# EAGLE design eTapper1main6 (EAGLE 8.2.2)
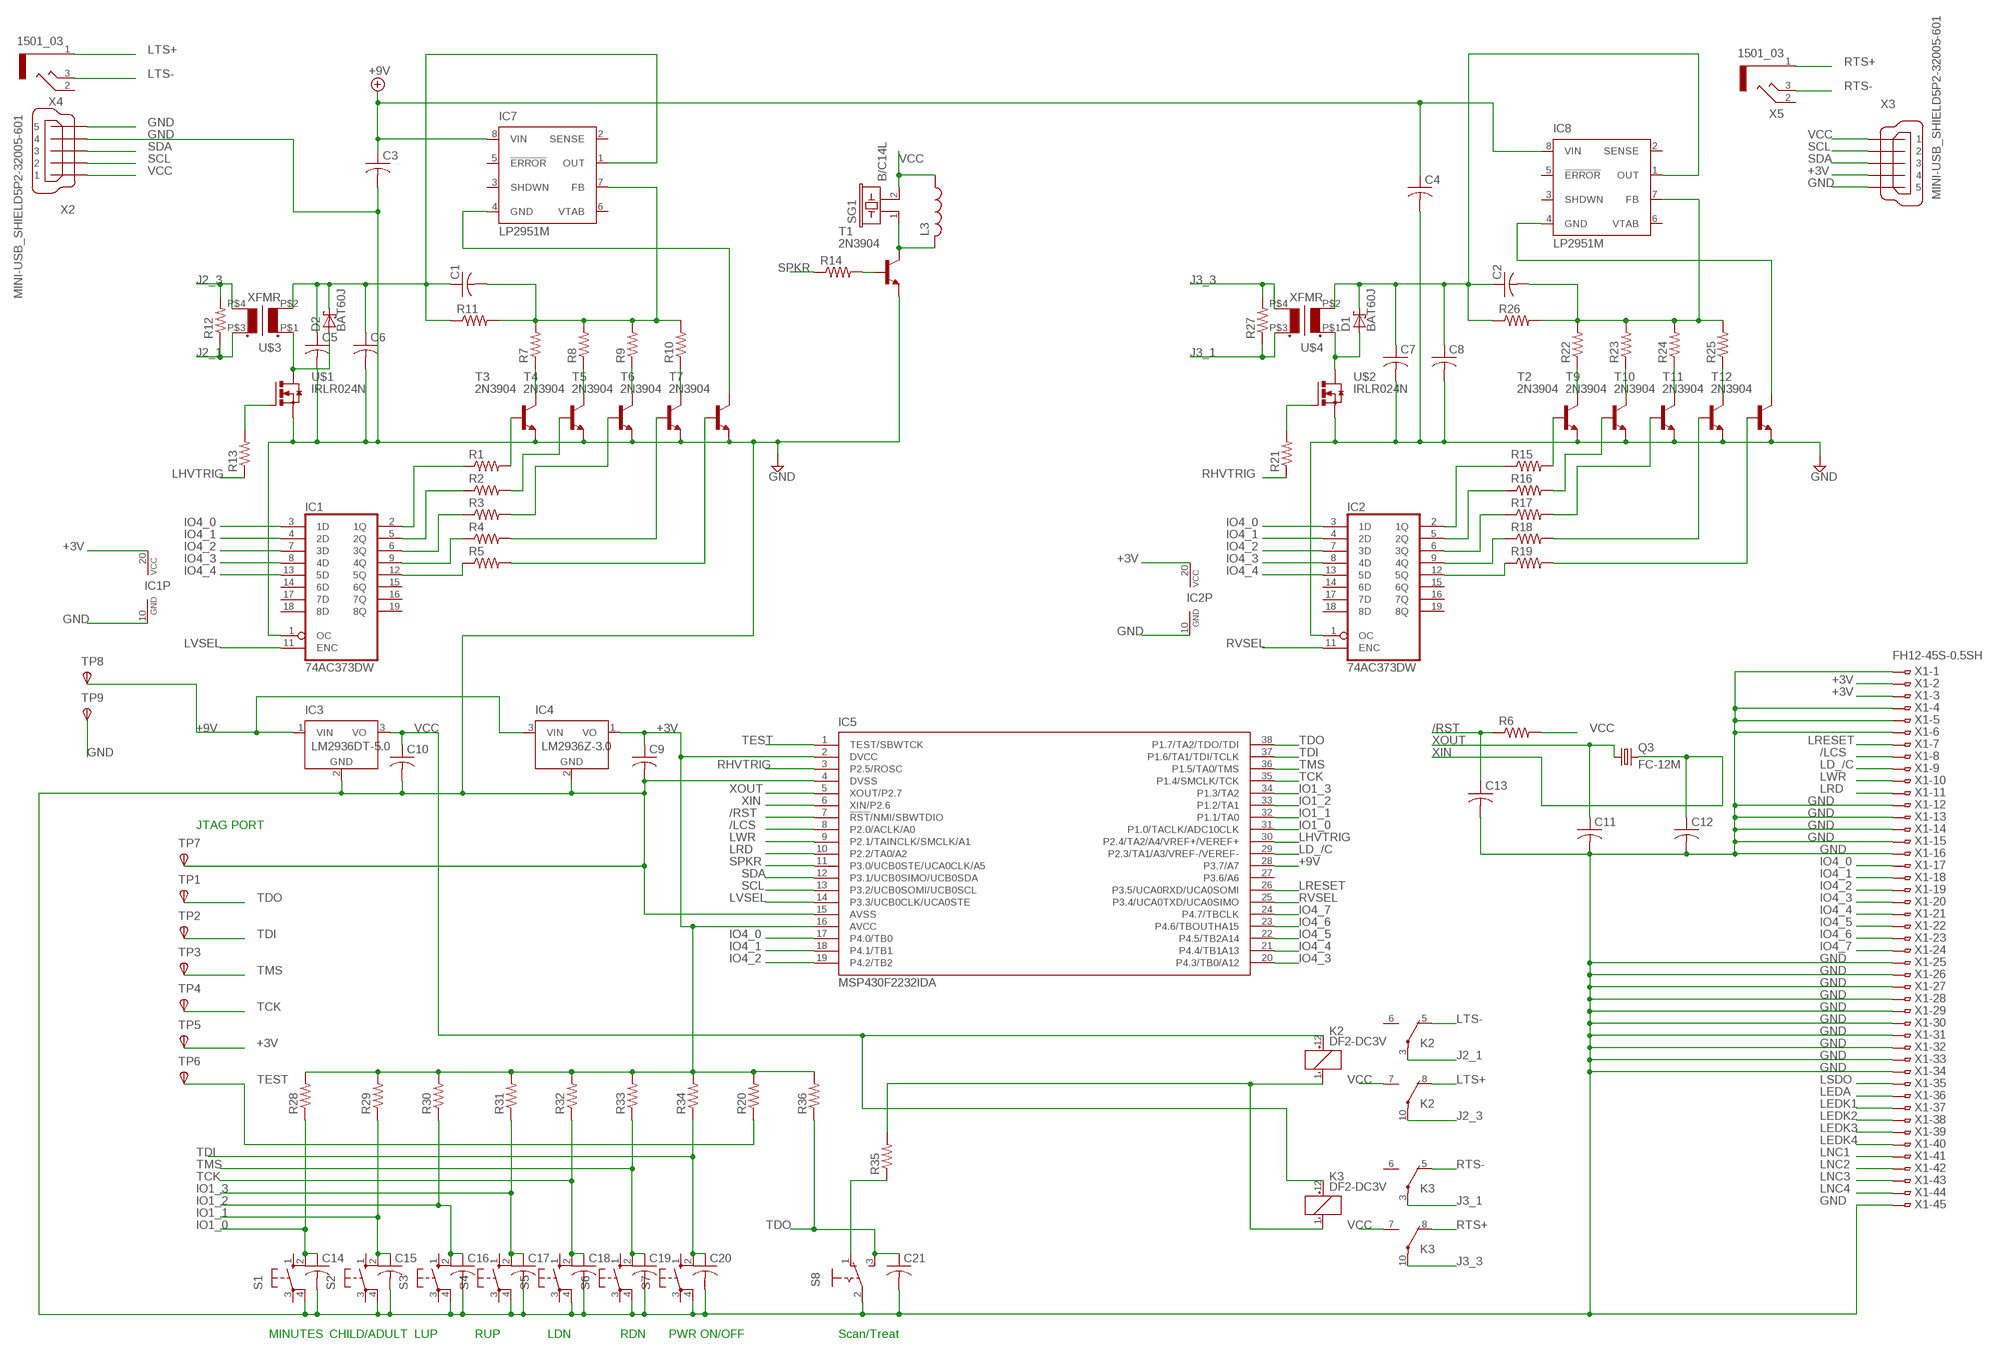
[diagram p0: schematic, sheet 1]

## Parts
C1  C-USC0805  [C0805]
C2  C-USC0805  [C0805]
C3  C-USC0805  [C0805]
C4  C-USC0805  [C0805]
C5  C-USC0805  [C0805]
C6  C-USC0805  [C0805]
C7  C-USC0805  [C0805]
C8  C-USC0805  [C0805]
C9  C-USC0805  [C0805]
C10  C-USC0805  [C0805]
C11  C-USC0805  [C0805]
C12  C-USC0805  [C0805]
C13  C-USC0805  [C0805]
C14  C-USC0805  [C0805]
C15  C-USC0805  [C0805]
C16  C-USC0805  [C0805]
C17  C-USC0805  [C0805]
C18  C-USC0805  [C0805]
C19  C-USC0805  [C0805]
C20  C-USC0805  [C0805]
C21  C-USC0805  [C0805]
D1  BAT60J  [SOD323_ST]
D2  BAT60J  [SOD323_ST]
IC1  74AC373DW  [SO20W]
IC2  74AC373DW  [SO20W]
IC3  LM2936DT-5.0  [TO252]
IC4  LM2936Z-3.0  [TO92]
IC5  MSP430F2232IDA  [TSSOP38_R-PDSO-G38-DA]
IC7  LP2951M  [SO08]
IC8  LP2951M  [SO08]
K2  DF2-DC3V  [DF2]
K3  DF2-DC3V  [DF2]
L3  L-USL2825P  [L2825P]
Q3  FC-12M  [FC-12M]
R1  R-US_R0402  [R0402]
R2  R-US_R0402  [R0402]
R3  R-US_R0402  [R0402]
R4  R-US_R0402  [R0402]
R5  R-US_R0402  [R0402]
R6  R-US_R0402  [R0402]
R7  R-US_R0402  [R0402]
R8  R-US_R0402  [R0402]
R9  R-US_R0402  [R0402]
R10  R-US_R0402  [R0402]
R11  R-US_R0402  [R0402]
R12  R-US_R0402  [R0402]
R13  R-US_R0402  [R0402]
R14  R-US_R0402  [R0402]
R15  R-US_R0402  [R0402]
R16  R-US_R0402  [R0402]
R17  R-US_R0402  [R0402]
R18  R-US_R0402  [R0402]
R19  R-US_R0402  [R0402]
R20  R-US_R0402  [R0402]
R21  R-US_R0402  [R0402]
R22  R-US_R0402  [R0402]
R23  R-US_R0402  [R0402]
R24  R-US_R0402  [R0402]
R25  R-US_R0402  [R0402]
R26  R-US_R0402  [R0402]
R27  R-US_R0402  [R0402]
R28  R-US_R0402  [R0402]
R29  R-US_R0402  [R0402]
R30  R-US_R0402  [R0402]
R31  R-US_R0402  [R0402]
R32  R-US_R0402  [R0402]
R33  R-US_R0402  [R0402]
R34  R-US_R0402  [R0402]
R35  R-US_R0402  [R0402]
R36  R-US_R0402  [R0402]
S1  10-XX  [B3F-10XX]
S2  10-XX  [B3F-10XX]
S3  10-XX  [B3F-10XX]
S4  10-XX  [B3F-10XX]
S5  10-XX  [B3F-10XX]
S6  10-XX  [B3F-10XX]
S7  10-XX  [B3F-10XX]
S8  M251  [M251]
SG1  B/C14L  [B/C14L]
T1  2N3904  [TO92]
T2  2N3904  [TO92]
T3  2N3904  [TO92]
T4  2N3904  [TO92]
T5  2N3904  [TO92]
T6  2N3904  [TO92]
T7  2N3904  [TO92]
T9  2N3904  [TO92]
T10  2N3904  [TO92]
T11  2N3904  [TO92]
T12  2N3904  [TO92]
TP1  TPSTP06R  [TP06R]
TP2  TPSTP06R  [TP06R]
TP3  TPSTP06R  [TP06R]
TP4  TPSTP06R  [TP06R]
TP5  TPSTP06R  [TP06R]
TP6  TPSTP06R  [TP06R]
TP7  TPSTP06R  [TP06R]
TP8  TPSTP06R  [TP06R]
TP9  TPSTP06R  [TP06R]
U$1  IRLR024N  [I-PAK_TO251AA]
U$2  IRLR024N  [I-PAK_TO251AA]
U$3  XFMR  [XFMR]
U$4  XFMR  [XFMR]
X1  FH12-45S-0.5SH  [FH12-45S-0.5SH]
X2  MINI-USB_SHIELD5P2-32005-601  [32005-601]
X3  MINI-USB_SHIELD5P2-32005-601  [32005-601]
X4  1501_03  [1501_03]
X5  1501_03  [1501_03]

## Nets
+3V: C9.1 IC1.20(VCC) IC2.20(VCC) IC4.1(VO) IC5.2(DVCC) IC5.16(AVCC) R20.2 R28.2 R29.2 R30.2 R31.2 R32.2 R33.2 R34.2 R36.2 TP5.TP(PP) X1.2 X1.3 X3.4
+9V: C3.1 C4.1 IC3.1(VIN) IC4.3(VIN) IC5.28(P3.7/A7) IC7.8(VIN) IC8.8(VIN) TP8.TP(PP)
/LCS: IC5.8(P2.0/ACLK/A0) X1.8
/RST: C13.1 IC5.7(!RST!/NMI/SBWTDIO) R6.1
GND: C3.2 C4.2 C5.2 C6.2 C7.2 C8.2 C9.2 C10.2 C11.2 C12.2 C13.2 C14.2 C15.2 C16.2 C17.2 C18.2 C19.2 C20.2 C21.2 IC1.1(OC) IC1.10(GND) IC2.1(OC) IC2.10(GND) IC3.2(GND) IC4.2(GND) IC5.4(DVSS) IC5.15(AVSS) S1.4(P1) S2.4(P1) S3.4(P1) S4.4(P1) S5.4(P1) S6.4(P1) S7.4(P1) S8.2(P) T1.3(E) T2.3(E) T3.3(E) T4.3(E) T5.3(E) T6.3(E) T7.3(E) T9.3(E) T10.3(E) T11.3(E) T12.3(E) TP7.TP(PP) TP9.TP(PP) U$1.3(S) U$2.3(S) X1.1 X1.4 X1.5 X1.6 X1.12 X1.13 X1.14 X1.15 X1.16 X1.25 X1.26 X1.27 X1.28 X1.29 X1.30 X1.31 X1.32 X1.33 X1.34 X1.45 X2.4 X2.5 X3.5
IO1_0: C14.1 IC5.31(P1.0/TACLK/ADC10CLK) R28.1 S1.2(S1)
IO1_1: C15.1 IC5.32(P1.1/TA0) R29.1 S2.2(S1)
IO1_2: C16.1 IC5.33(P1.2/TA1) R30.1 S3.2(S1)
IO1_3: C17.1 IC5.34(P1.3/TA2) R31.1 S4.2(S1)
IO4_0: IC1.3(1D) IC2.3(1D) IC5.17(P4.0/TB0) X1.17
IO4_1: IC1.4(2D) IC2.4(2D) IC5.18(P4.1/TB1) X1.18
IO4_2: IC1.7(3D) IC2.7(3D) IC5.19(P4.2/TB2) X1.19
IO4_3: IC1.8(4D) IC2.8(4D) IC5.20(P4.3/TB0/A12) X1.20
IO4_4: IC1.13(5D) IC2.13(5D) IC5.21(P4.4/TB1A13) X1.21
IO4_5: IC5.22(P4.5/TB2A14) X1.22
IO4_6: IC5.23(P4.6/TBOUTHA15) X1.23
IO4_7: IC5.24(P4.7/TBCLK) X1.24
J2_1: K2.3(2:P) R12.1 U$3.P$3(S1)
J2_3: K2.10(3:P) R12.2 U$3.P$4(S2)
J3_1: K3.3(2:P) R27.1 U$4.P$3(S1)
J3_3: K3.10(3:P) R27.2 U$4.P$4(S2)
LD_/C: IC5.29(P2.3/TA1/A3/VREF-/VEREF-) X1.9
LEDA: X1.36
LEDK1: X1.37
LEDK2: X1.38
LEDK3: X1.39
LEDK4: X1.40
LHVTRIG: IC5.30(P2.4/TA2/A4/VREF+/VEREF+) R13.1
LNC1: X1.41
LNC2: X1.42
LNC3: X1.43
LNC4: X1.44
LRD: IC5.10(P2.2/TA0/A2) X1.11
LRESET: IC5.26(P3.5/UCA0RXD/UCA0SOMI) X1.7
LSDO: X1.35
LTS+: K2.8(3:O) X4.1
LTS-: K2.5(2:O) X4.3
LVSEL: IC1.11(ENC) IC5.14(P3.3/UCB0CLK/UCA0STE)
LWR: IC5.9(P2.1/TAINCLK/SMCLK/A1) X1.10
N$1: IC1.2(1Q) R1.1
N$2: IC1.5(2Q) R2.1
N$3: IC1.6(3Q) R3.1
N$4: IC1.9(4Q) R4.1
N$5: IC1.12(5Q) R5.1
N$6: L3.2 SG1.1 T1.1(C)
N$7: R4.2 T6.2(B)
N$8: R5.2 T7.2(B)
N$9: D2.A U$1.2(D) U$1.4(D) U$3.P$1(P1)
N$10: R7.1 T3.1(C)
N$11: R8.1 T4.1(C)
N$12: R9.1 T5.1(C)
N$13: R1.2 T3.2(B)
N$14: R2.2 T4.2(B)
N$15: R3.2 T5.2(B)
N$16: R10.1 T6.1(C)
N$17: C1.2 IC7.7(FB) R7.2 R8.2 R9.2 R10.2 R11.2
N$18: C1.1 C5.1 C6.1 D2.C IC7.1(OUT) R11.1 U$3.P$2(P2)
N$19: D1.A U$2.2(D) U$2.4(D) U$4.P$1(P1)
N$20: IC2.2(1Q) R15.1
N$21: R13.2 U$1.1(G)
N$22: R14.2 T1.2(B)
N$23: R35.1 S8.1(O)
N$24: IC2.5(2Q) R16.1
N$25: IC2.6(3Q) R17.1
N$26: IC2.9(4Q) R18.1
N$27: IC2.12(5Q) R19.1
N$29: R15.2 T2.2(B)
N$30: R16.2 T9.2(B)
N$31: R17.2 T10.2(B)
N$32: R18.2 T11.2(B)
N$33: R19.2 T12.2(B)
N$34: K2.1(1:-) K3.1(1:-) R35.2
N$35: R22.1 T2.1(C)
N$36: R23.1 T9.1(C)
N$37: R24.1 T10.1(C)
N$38: R25.1 T11.1(C)
N$39: C2.2 IC8.7(FB) R22.2 R23.2 R24.2 R25.2 R26.2
N$40: C2.1 C7.1 C8.1 D1.C IC8.1(OUT) R26.1 U$4.P$2(P2)
N$42: R21.2 U$2.1(G)
N$45: IC7.4(GND) T7.1(C)
N$47: IC8.4(GND) T12.1(C)
RHVTRIG: IC5.3(P2.5/ROSC) R21.1
RTS+: K3.8(3:O) X5.1
RTS-: K3.5(2:O) X5.3
RVSEL: IC2.11(ENC) IC5.25(P3.4/UCA0TXD/UCA0SIMO)
SCL: IC5.13(P3.2/UCB0SOMI/UCB0SCL) X2.2 X3.2
SDA: IC5.12(P3.1/UCB0SIMO/UCB0SDA) X2.3 X3.3
SPKR: IC5.11(P3.0/UCB0STE/UCA0CLK/A5) R14.1
TCK: C18.1 IC5.35(P1.4/SMCLK/TCK) R32.1 S5.2(S1) TP4.TP(PP)
TDI: C20.1 IC5.37(P1.6/TA1/TDI/TCLK) R34.1 S7.2(S1) TP2.TP(PP)
TDO: C21.1 IC5.38(P1.7/TA2/TDO/TDI) R36.1 S8.3(S) TP1.TP(PP)
TEST: IC5.1(TEST/SBWTCK) R20.1 TP6.TP(PP)
TMS: C19.1 IC5.36(P1.5/TA0/TMS) R33.1 S6.2(S1) TP3.TP(PP)
VCC: C10.1 IC3.3(VO) K2.7(3:S) K2.12(1:+) K3.7(3:S) K3.12(1:+) L3.1 R6.2 SG1.2 X2.1 X3.1
XIN: C12.1 IC5.6(XIN/P2.6) Q3.2
XOUT: C11.1 IC5.5(XOUT/P2.7) Q3.1
Unconnected: IC1.14(6D) IC1.15(6Q) IC1.16(7Q) IC1.17(7D) IC1.18(8D) IC1.19(8Q) IC2.14(6D) IC2.15(6Q) IC2.16(7Q) IC2.17(7D) IC2.18(8D) IC2.19(8Q) IC5.27(P3.6/A6) IC7.2(SENSE) IC7.3(SHDWN) IC7.5(!ERROR) IC7.6(VTAB) IC8.2(SENSE) IC8.3(SHDWN) IC8.5(!ERROR) IC8.6(VTAB) K2.6(2:S) K3.6(2:S) S1.1(S) S1.3(P) S2.1(S) S2.3(P) S3.1(S) S3.3(P) S4.1(S) S4.3(P) S5.1(S) S5.3(P) S6.1(S) S6.3(P) S7.1(S) S7.3(P) X2.M1(S1) X2.M2(S2) X3.M1(S1) X3.M2(S2) X4.2 X5.2

## Notes on the sheet
- JTAG PORT
- MINUTES | CHILD/ADULT | LUP | RUP | LDN | RDN | PWR ON/OFF | Scan/Treat

## Library data of the parts
C1-C21 = rcl:C-US: CAPACITOR, American symbol
D1 D2 = diode:BAT60J: Schottky barrier diode Source: www.st.com, BAT60J.pdf
IC1 IC2 = 74xx-eu:74*373: Octal D type transparent LATCH, edge triggered
IC3 = national-semiconductor:LM2936?*: Ultra-Low Quiescent Current LDO Voltage Regulator Source: Data sheet <http://www.national.com/ds/LM/LM2936.pdf>; MF: NATIONAL SEMICONDUCTOR; MPN: LM2936DT-5.0/NOPB; OC_FARNELL: 1286864; OC_NEWARK: 41K4501
IC4 = national-semiconductor:LM2936?*: Ultra-Low Quiescent Current LDO Voltage Regulator Source: Data sheet <http://www.national.com/ds/LM/LM2936.pdf>; MF: NATIONAL SEMICONDUCTOR; MPN: LM2936Z-3.0/NOPB; OC_FARNELL: 1312709; OC_NEWARK: 41K4531
IC5 = texas:MSP430F22*2IDA: MIXED SIGNAL MICROCONTROLLER Source: http://focus.ti.com/lit/ds/symlink/msp430f2274.pdf; MPN: MSP430F2232IDA; OC_FARNELL: 1610178; OC_NEWARK: 28M6312
IC7 IC8 = national-semiconductor:LP2951: Adjustable Micropower Voltage Regulator Source: http://www.national.com/ds/LP/LP2950.pdf; MF: FAIRCHILD SEMICONDUCTOR; MPN: LP2951CM; OC_FARNELL: 9488561; OC_NEWARK: 78K6014
K2 K3 = relay:DF2-?DC*: HIGHLY SENSITIVE DIP MINIATURE RELAY NAiS Single side stable / 1 coil latching Source: http://www.mew-europe.com/.. en_ds_61002_0000.pdf; OC_FARNELL: unknown; OC_NEWARK: unknown
L3 = rcl:L-US: INDUCTOR, American symbol
Q3 = crystal:FC-12M: kHz RANGE CRYSTAL UNIT LOW PROFILE SMD Source: Epson Toyocom FC-12M.pdf
R1-R36 = resistor:R-US_: RESISTOR, American symbol
S1-S7 = switch-omron:10-XX: OMRON SWITCH; MPN: B3F-1000; OC_FARNELL: 176432; OC_NEWARK: 36M3542
S8 = switch:M251: SLIDING SWITCH Mors, distributor Buerklin, 11G702
SG1 = buzzer:B/C14L: BUZZER Source: Buerklin; OC_FARNELL: unknown; OC_NEWARK: unknown
T1-T7 T9-T12 = transistor-neu-to92:2N3904: NPN TRANSISTOR
TP1-TP9 = testpad:TPS: TEST PIN
U$1 U$2 = IRLR024N:IRLR024N: IRLR024N HEXFET Power Mosfet N channel Infeneon Technology TO-251AA IPAK
U$3 U$4 = XFMR:XFMR: Transformer 1"X1" 0.4"X0.4" hole separation for e_tapper
X1 = con-hirose:FH12-45S-0.5S: 0.5mm Pitch Connectors For FPC/FFC Source: Data sheet <http://www.hirose.co.jp/cataloge_hp/e58605370.pdf>; OC_FARNELL: unknown; OC_NEWARK: unknown
X2 X3 = con-cypressindustries:MINI-USB_SHIELD5P2-: MINI USB-B R/A DIP 5pol. Source: www.cypressindustries.com; OC_FARNELL: unknown; OC_NEWARK: unknown
X4 X5 = con-lumberg:1501_03: Klinkensteckverbinder nach JISC 6560, 2,5 mm Jack connectors according to JISC 6560, 2.5 mm Source: http://www.lumberg.com/Produkte/PDFs/1501_03.pdf; OC_FARNELL: 1200127; OC_NEWARK: unknown

## Module LP2951
Ports: 

### Library data of the parts

## Board
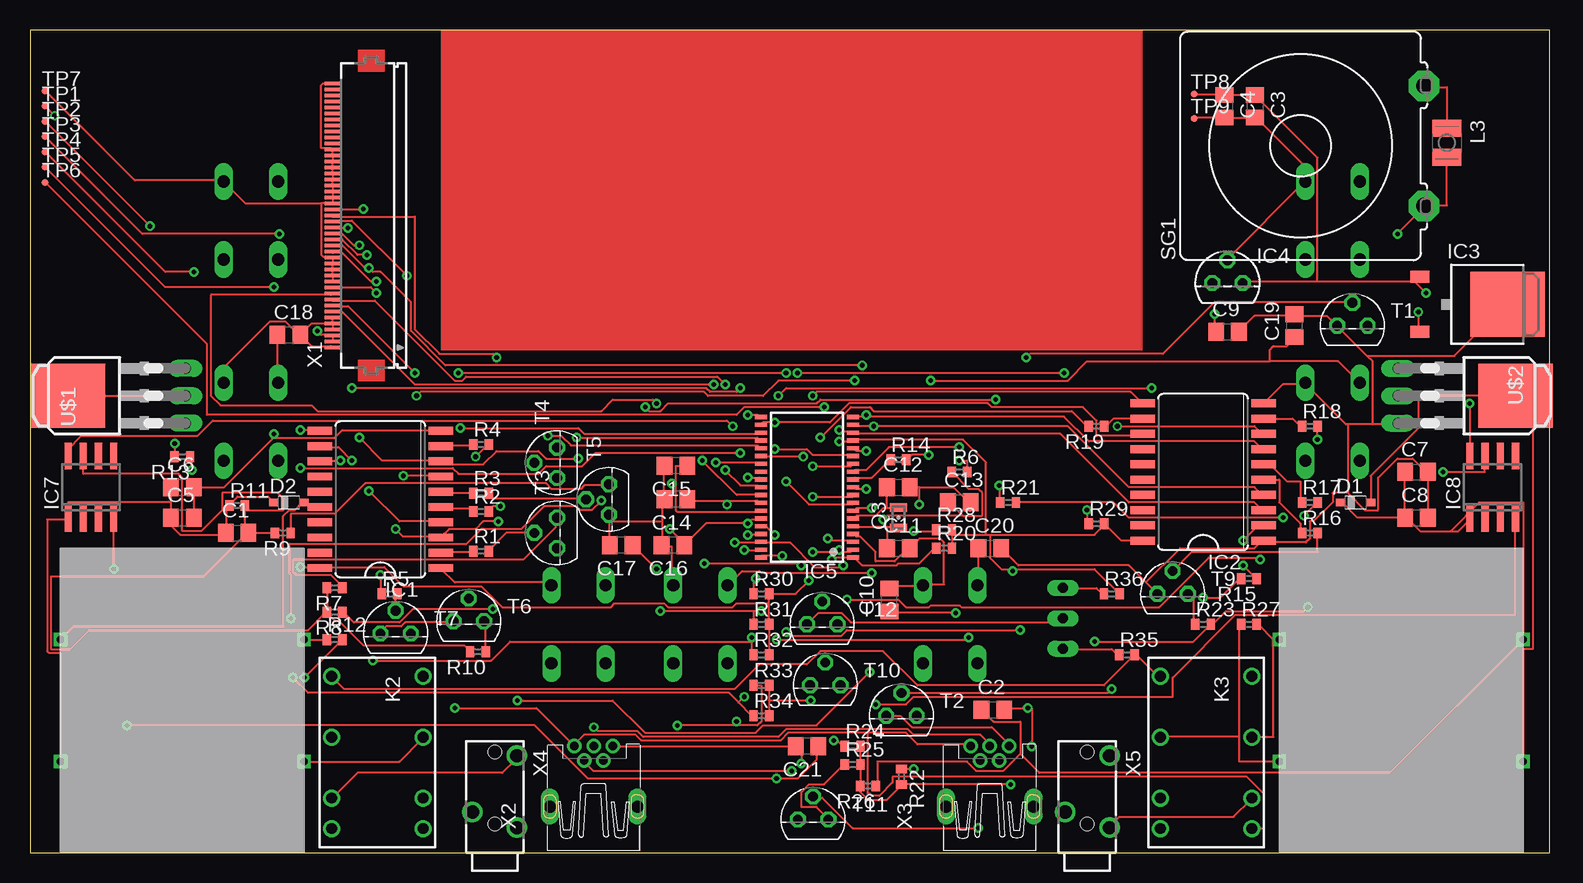
[diagram p1: board, top side]
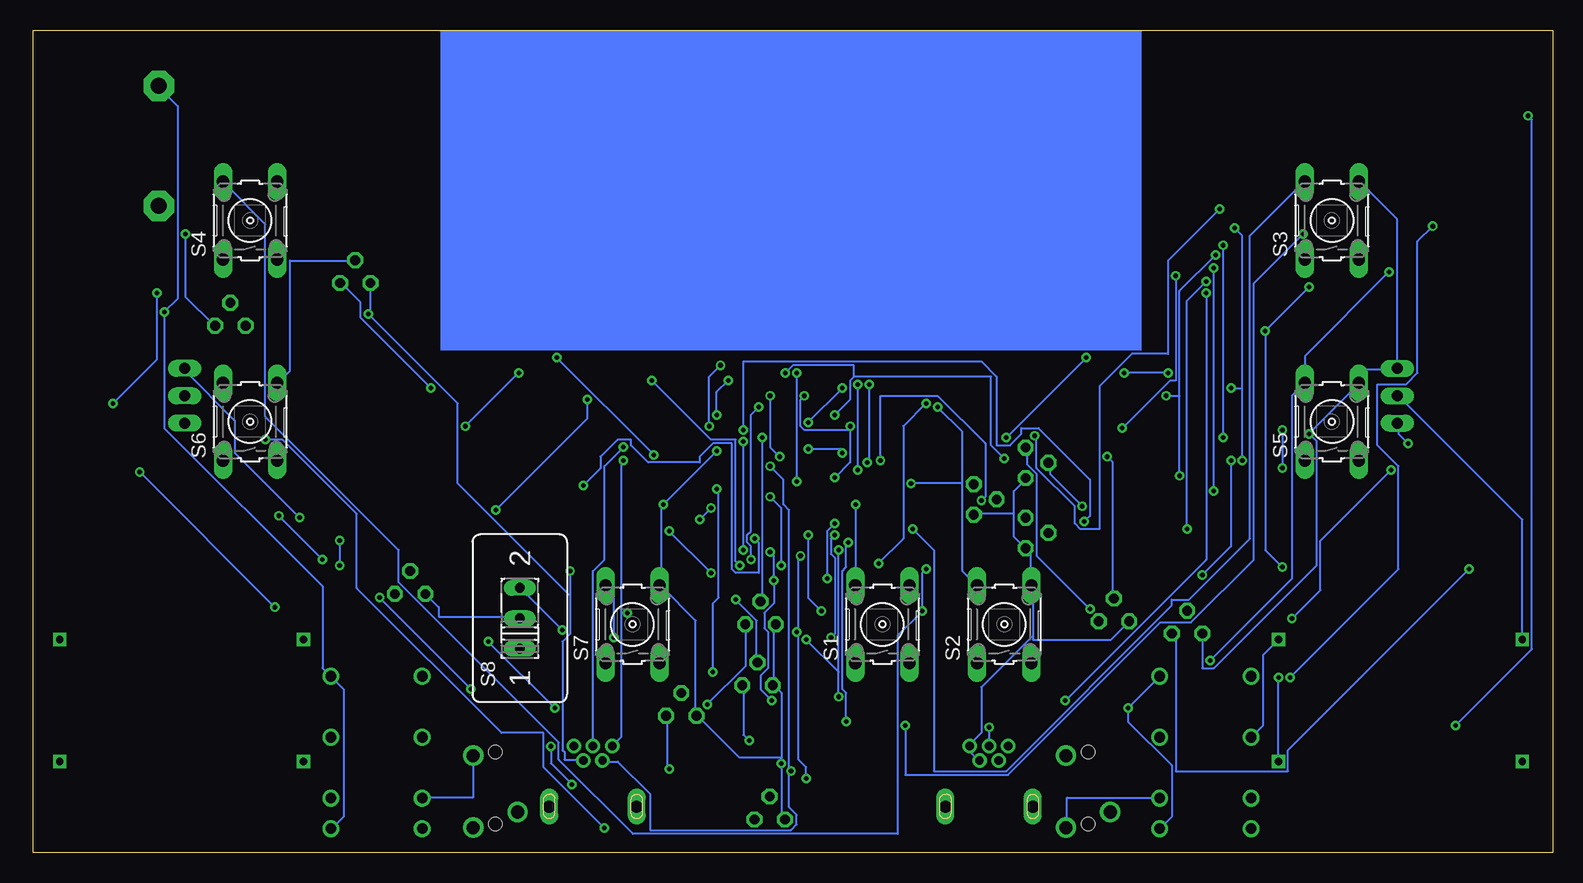
[diagram p2: board, bottom side, seen from below]

Size 126.67 x 68.57 mm. Coordinates in mm from the lower left corner, seen from the top.
Outline: 0,0 126.67,0 126.67,68.57 0,68.57 0,0
Copper layers (1*16): Top 0.035mm / dielectric 1.5mm / Bottom 0.035mm
Design rules "default *": minimum track width 6mil, minimum drill 15mil, track to track 6mil, track to pad 6mil, pad to pad 6mil, via to via 6mil, smd to smd 6mil, copper to edge 40mil, drill to drill 6mil, minimum pad ring 10mil, minimum via ring 8mil, stop-mask expansion 4mil, vias tented up to drill 0mil, thermal gap 10mil

### Footprints (pad centres in the part's own frame; a part is rotated, then mirrored left to right if it is on the bottom)
C0805 = smd 1.3 x 1.5: 1 -0.95,0; 2 0.95,0
SOD323_ST = smd 0.8 x 0.6: A 1.25,0; C -1.25,0
SO20W = smd 0.66 x 2.032: 1 -5.715,-5.029; 2 -4.445,-5.029; 3 -3.175,-5.029; 4 -1.905,-5.029; 5 -0.635,-5.029; 6 0.635,-5.029; 7 1.905,-5.029; 8 3.175,-5.029; 9 4.445,-5.029; 10 5.715,-5.029; 11 5.715,5.029; 12 4.445,5.029; 13 3.175,5.029; 14 1.905,5.029; 15 0.635,5.029; 16 -0.635,5.029; 17 -1.905,5.029; 18 -3.175,5.029; 19 -4.445,5.029; 20 -5.715,5.029
TO252 = smd 1 x 1.6: 1 -2.28,-4.8; 3 2.28,-4.8 | smd 5.4 x 6.2: 2 0,2.5
TO92 = drill 0.813 pad 1.27 octagon: 1 -1.27,0; 2 0,1.905; 3 1.27,0
TSSOP38_R-PDSO-G38-DA = smd 0.35 x 1: 1 -5.85,-3.85; 2 -5.2,-3.85; 3 -4.55,-3.85; 4 -3.9,-3.85; 5 -3.25,-3.85; 6 -2.6,-3.85; 7 -1.95,-3.85; 8 -1.3,-3.85; 9 -0.65,-3.85; 10 0,-3.85; 11 0.65,-3.85; 12 1.3,-3.85; 13 1.95,-3.85; 14 2.6,-3.85; 15 3.25,-3.85; 16 3.9,-3.85; 17 4.55,-3.85; 18 5.2,-3.85; 19 5.85,-3.85; 20 5.85,3.85; 21 5.2,3.85; 22 4.55,3.85; 23 3.9,3.85; 24 3.25,3.85; 25 2.6,3.85; 26 1.95,3.85; 27 1.3,3.85; 28 0.65,3.85; 29 0,3.85; 30 -0.65,3.85; 31 -1.3,3.85; 32 -1.95,3.85; 33 -2.6,3.85; 34 -3.25,3.85; 35 -3.9,3.85; 36 -4.55,3.85; 37 -5.2,3.85; 38 -5.85,3.85
SO08 = smd 0.6 x 2.2: 1 -1.905,-2.6; 2 -0.635,-2.6; 3 0.635,-2.6; 4 1.905,-2.6; 5 1.905,2.6; 6 0.635,2.6; 7 -0.635,2.6; 8 -1.905,2.6
DF2 = drill 0.9: 1 -6.35,-3.81; 3 -1.27,-3.81; 5 3.81,-3.81; 6 6.35,-3.81; 7 6.35,3.81; 8 3.81,3.81; 10 -1.27,3.81; 12 -6.35,3.81
L2825P = smd 1.4 x 2.4: 1 -1.2,0; 2 1.2,0
FC-12M = smd 0.7 x 1.4: 1 -0.85,0; 2 0.85,0
R0402 = smd 0.7 x 0.9: 1 -0.65,0; 2 0.65,0
B3F-10XX = drill 1.016 long: 1 -3.251,2.261; 2 3.251,2.261; 3 -3.251,-2.261; 4 3.251,-2.261
M251 = drill 0.813 long: 1 -2.54,0; 2 0,0; 3 2.54,0
B/C14L = drill 1.321 pad 2.54 octagon: 1 -5.004,-10.287; 2 5.004,-10.287
TO92' = drill 0.813 octagon: 1 1.27,0; 2 0,1.905; 3 -1.27,0
TP06R = smd 0.6 x 0.6: TP 0,0
I-PAK_TO251AA = drill 0.889 long: 1 -2.286,-5.334; 2 0,-5.334; 3 2.286,-5.334 | smd 5.334 x 6.223: 4 0,4.445
XFMR = drill 0.6 square: P$1 -10.16,5.08; P$2 -10.16,-5.08; P$3 10.16,5.08; P$4 10.16,-5.08
FH12-45S-0.5SH = smd 0.3 x 1.3: 1 -13,3.25; 2 -12.5,3.25; 3 -12,3.25; 4 -11.5,3.25; 5 -11,3.25; 6 -10.5,3.25; 7 -10,3.25; 8 -9.5,3.25; 9 -9,3.25; 10 -8.5,3.25; 11 -8,3.25; 12 -7.5,3.25; 13 -7,3.25; 14 -6.5,3.25; 15 -6,3.25; 16 -5.5,3.25; 17 -5,3.25; 18 -4.5,3.25; 19 -4,3.25; 20 -3.5,3.25; 21 -3,3.25; 22 -2.5,3.25; 23 -2,3.25; 24 -1.5,3.25; 25 -1,3.25; 26 -0.5,3.25; 27 0,3.25; 28 0.5,3.25; 29 1,3.25; 30 1.5,3.25; 31 2,3.25; 32 2.5,3.25; 33 3,3.25; 34 3.5,3.25; 35 4,3.25; 36 4.5,3.25; 37 5,3.25; 38 5.5,3.25; 39 6,3.25; 40 6.5,3.25; 41 7,3.25; 42 7.5,3.25; 43 8,3.25; 44 8.5,3.25; 45 9,3.25
32005-601 = drill 0.7 pad 1.016: 1 2.825,1.6; 2 1.625,0.8; 3 2.825,0; 4 1.625,-0.8; 5 2.825,-1.6 | drill 1 pad 1.422 long: M1 -2.225,3.65; M2 -2.225,-3.65
1501_03 = drill 1.1 pad 1.7: 1 -1.85,0.3; 2 1.85,-1; 3 -1.85,-5.7 | hole 1.1: 0,0; 0,-6

### Placement (x,y rotation side)
C1  17.27,26.67 0 top
C2  80.26,11.94 0 top
C3  102.11,62.23 270 top
C4  99.57,62.23 270 top
C5  12.7,27.94 0 top
C6  12.7,30.48 0 top
C7  115.57,31.75 0 top
C8  115.57,27.94 0 top
C9  99.82,43.43 0 top
C10  71.63,21.08 90 top
C11  72.39,25.4 0 top
C12  72.39,30.48 0 top
C13  77.47,29.21 0 top
C14  53.85,29.46 180 top
C15  53.85,32.26 180 top
C16  53.59,25.65 180 top
C17  49.28,25.65 180 top
C18  21.59,43.18 0 top
C19  105.41,43.94 90 top
C20  80.01,25.4 0 top
C21  64.77,8.89 180 top
D1  110.49,29.21 0 top
D2  21.59,29.21 0 top
IC1  29.21,29.46 90 top
IC2  97.79,31.75 90 top
IC3  120.65,45.72 270 top
IC4  99.82,47.5 0 top
IC5  64.77,30.48 90 top
IC7  5.08,30.48 0 top
IC8  121.92,30.48 0 top
K2  28.96,8.38 270 top
K3  98.04,8.38 270 top
L3  118.11,59.18 270 top
Q3  72.39,27.94 90 top
R1  37.59,25.15 0 top
R2  37.59,28.45 0 top
R3  37.59,29.97 0 top
R4  37.59,34.04 0 top
R5  29.97,21.59 0 top
R6  77.47,31.75 0 top
R7  25.4,22.1 180 top
R8  25.4,20.07 180 top
R9  21.08,26.67 180 top
R10  37.34,16.76 180 top
R11  17.27,28.96 0 top
R12  25.4,17.78 0 top
R13  12.7,33.02 180 top
R14  72.39,32.77 0 top
R15  101.6,22.86 180 top
R16  106.68,26.67 0 top
R17  106.68,29.21 0 top
R18  106.68,35.56 0 top
R19  88.9,35.56 180 top
R20  76.2,25.4 0 top
R21  81.53,29.21 0 top
R22  72.64,6.35 270 top
R23  97.79,19.05 0 top
R24  68.58,8.89 0 top
R25  68.58,7.37 0 top
R26  69.85,5.59 180 top
R27  101.6,19.05 0 top
R28  76.2,26.92 0 top
R29  88.9,27.43 0 top
R30  60.96,21.59 0 top
R31  60.96,19.05 0 top
R32  60.96,16.51 0 top
R33  60.96,13.97 0 top
R34  60.96,11.43 0 top
R35  91.44,16.51 0 top
R36  90.17,21.59 0 top
S1  55.88,19.05 90 bottom
S2  45.72,19.05 90 bottom
S3  18.41,52.7 90 bottom
S4  108.58,52.7 90 bottom
S5  18.41,35.94 90 bottom
S6  108.58,35.94 90 bottom
S7  76.71,19.05 90 bottom
S8  86.11,19.56 90 bottom
SG1  105.92,58.93 90 top
T1  2N3904  [TO92']  110.24,43.94 0 top
T2  2N3904  [TO92']  72.64,11.43 0 top
T3  2N3904  [TO92']  43.94,26.67 90 top
T4  2N3904  [TO92']  43.94,32.51 90 top
T5  2N3904  [TO92']  48.26,29.46 90 top
T6  2N3904  [TO92']  36.58,19.3 0 top
T7  2N3904  [TO92']  30.48,18.29 0 top
T9  2N3904  [TO92']  95.25,21.59 0 top
T10  2N3904  [TO92']  66.29,13.97 0 top
T11  2N3904  [TO92']  65.28,2.79 0 top
T12  2N3904  [TO92']  66.04,19.05 0 top
TP1  1.27,62.23 0 top
TP2  1.27,60.96 0 top
TP3  1.27,59.69 0 top
TP4  1.27,58.42 0 top
TP5  1.27,57.15 0 top
TP6  1.27,55.88 0 top
TP7  1.27,63.5 0 top
TP8  97.03,63.25 0 top
TP9  97.03,61.21 0 top
U$1  7.62,38.1 90 top
U$2  119.38,38.1 270 top
U$3  12.7,12.7 0 top
U$4  114.3,12.7 180 top
X1  28.45,55.12 90 top
X2  46.99,6.1 90 top
X3  80.01,6.1 90 top
X4  38.73,2.41 180 top
X5  88.14,2.41 180 top

### Tracks (layer width: path | path; a pad name or v marks a point on that pad's centre or on a via)
+3V  (via drill 0.38)
  Top 0.152: v98.74,44.93 98.74,43.5 C9.1 | IC2.20 90.96,26.04 89.69,27.3 R29.2 89.53,27.3 88.74,26.51 80.01,26.51 | 76.83,26.51 76.83,26.83 R28.2 76.83,26.51 | 76.83,26.51 76.83,25.4 R20.2 | 81.92,23.65 80.96,23.65 80.01,24.61 80.01,26.51 | 81.92,23.65 88.74,23.65 90.81,21.59 R36.2 | 76.83,26.51 79.69,26.51 | 79.69,26.51 80.01,26.51 | 79.69,26.51 79.69,32.54 77.79,34.45 68.74,34.45 IC5.16 68.58,34.29 v67.47,34.29 | 81.92,23.65 v81.92,23.5 | 61.59,12.7 61.59,13.97 R33.2 | 61.59,12.7 61.59,11.43 R34.2 | 61.59,19.05 61.59,16.51 R32.2 | 61.59,19.05 61.59,20.8 | 61.59,20.8 61.59,21.59 R30.2 63.82,21.59 v64.93,22.7 | 61.59,19.05 R31.2 | v65.25,25.08 67.47,25.08 | 67.47,25.08 68.42,25.08 68.58,25.24 IC5.2 | v65.09,12.7 61.59,12.7 | TP5.TP 11.27,47.15 v20.32,47.15 | v23.97,43.5 24.29,43.18 25.08,43.18 X1.3 25.24,43.02 25.24,42.7 X1.2 | v22.54,23.81 24.13,23.81 IC1.20 24.29,23.81 29.53,23.81 31.11,22.23 37.62,22.23 39.37,20.48 48.42,20.48 48.74,20.8 52.86,20.8 53.18,20.48 58.58,20.48 58.9,20.8 61.59,20.8 | 67.47,25.08 v67.47,25.24
  Bottom 0.152: IC4.1 98.58,47.47 98.58,45.09 v98.74,44.93 91.28,37.47 91.28,30.8 81.92,21.43 | v81.92,23.5 81.92,21.43 | 81.92,21.43 81.92,18.26 82.55,17.62 82.55,8.57 82.39,8.41 82.39,7.78 80.96,7.78 X3.4 | v65.25,25.08 64.93,24.77 v64.93,22.7 64.93,20.8 65.72,20 65.72,18.73 65.41,18.41 65.41,15.4 66.04,14.76 66.04,13.65 v65.09,12.7 | v20.32,47.15 v23.97,43.5 23.97,25.24 v22.54,23.81 | v67.47,25.24 v67.47,34.29
+9V  (via drill 0.38)
  Top 0.152: TP8.TP 97.16,63.18 99.54,63.18 C4.1 99.69,63.18 102.08,63.18 C3.1 102.23,63.02 107.31,57.94 107.31,47.62 | 115.41,47.62 115.73,47.94 IC3.1 115.41,47.62 | 107.31,47.62 101.12,47.62 IC4.3 | 107.31,47.62 115.41,47.62 | v120.02,37.47 IC8.8 | 115.41,47.62 v116.36,46.67 | v59.85,31.27 60.8,31.27 IC5.28 | v58.58,35.56 58.1,36.04 15.24,36.04 13.97,34.77 4.29,34.77 3.17,33.66 IC7.8 | v93.5,38.73 63.02,38.73 v62.39,38.1
  Bottom 0.152: v120.02,37.47 116.36,41.12 v116.36,46.67 | v59.85,31.27 58.58,32.54 58.58,35.24 | v93.5,38.73 99.38,44.61 99.38,45.88 100.97,47.47 IC4.3 | v62.39,38.1 62.71,37.78 62.71,35.56 62.39,35.24 58.58,35.24 | 58.58,35.24 v58.58,35.56
/LCS  (via drill 0.38)
  Top 0.152: v63.02,30.96 64.93,29.05 68.58,29.05 IC5.8 | v35.72,40.01 v63.02,40.01 | v32.07,40.01 26.51,45.56 25.24,45.56 X1.8
  Bottom 0.152: v63.02,40.01 v63.02,30.96 | v32.07,40.01 v35.72,40.01
/RST  (via drill 0.38)
  Top 0.152: 77.79,28.1 79.38,28.1 79.38,30 79.06,30.32 78.26,30.32 76.83,31.75 R6.1 | 77.79,28.1 76.68,29.21 C13.1 | v70.17,28.73 68.9,28.73 68.74,28.57 IC5.7 | v71.12,27.78 71.44,28.1 77.79,28.1
  Bottom 0.152: v71.12,27.78 v70.17,28.73
GND  (via drill 0.38)
  Top 0.152: T9.3 93.03,22.54 | 93.03,22.54 91.6,23.97 82.39,23.97 C20.2 | 93.03,22.54 95.89,25.4 102.08,25.4 102.71,26.04 IC2.1 102.87,26.04 103.03,25.88 106.36,25.88 106.68,26.19 106.68,27.62 107,27.62 108.58,29.21 108.58,30 109.86,30 | TP9.TP 97.16,61.28 99.54,61.28 C4.2 99.69,61.28 102.08,61.28 C3.2 102.23,61.28 106.2,57.31 106.2,56.04 S4.4 106.2,55.88 99.85,49.53 IC4.2 | 105.41,44.77 102.08,44.77 100.81,43.5 C9.2 | 105.41,44.77 108.11,44.77 108.9,43.97 T1.3 109.06,43.81 111.44,41.43 | 105.41,44.77 C19.2 | IC2.10 102.87,37.47 104.46,39.05 106.2,39.05 S6.4 106.36,39.05 109.7,35.72 109.86,35.72 | C8.2 C7.2 116.36,31.75 115.25,32.86 113.98,32.86 112.39,31.27 112.39,28.57 111.28,28.57 109.86,30 | 109.86,35.72 109.86,30 | 111.92,35.72 113.98,35.72 U$2.3 | 111.92,35.72 109.86,35.72 | 111.44,41.43 111.92,40.96 111.92,35.72 | 111.44,41.43 118.75,41.43 123.03,45.72 IC3.2 | C6.2 C5.2 | 20.32,34.61 25.4,34.61 26.04,35.24 34.13,35.24 IC1.10 | 20.32,34.61 16.19,30.48 C6.2 | C6.2 | X1.4 25.24,43.66 25.24,43.97 X1.5 | X1.6 25.24,44.61 25.24,44.13 X1.5 | C18.2 23.5,42.23 25.08,42.23 X1.1 | C18.2 23.5,44.13 25.08,44.13 X1.5 | C18.2 22.38,43.18 21.27,44.29 20,44.29 16.19,40.48 16.19,39.21 S5.4 | 25.24,57.63 25.24,58.1 X1.33 25.24,58.26 25.24,58.58 X1.34 25.08,58.74 24.29,58.74 24.29,63.98 24.45,64.14 25.08,64.14 X1.45 | X1.12 25.24,47.62 25.24,48.1 X1.13 25.24,48.26 25.24,48.58 X1.14 25.24,48.74 25.24,49.05 X1.15 25.24,49.21 25.24,49.53 X1.16 25.08,49.69 24.45,49.69 24.29,49.85 24.29,54.13 | 25.24,54.61 25.24,54.13 X1.25 25.08,54.13 24.29,54.13 | 25.24,54.61 25.24,55.09 X1.27 25.24,55.24 25.24,55.56 X1.28 25.24,55.72 25.24,56.04 X1.29 25.24,56.2 25.24,56.52 X1.30 25.24,56.67 25.24,56.99 X1.31 25.24,57.15 25.24,57.63
  Top 0.152: 25.24,54.61 X1.26 | 25.24,57.63 X1.32 | TP7.TP 8.73,56.04 16.03,56.04 S3.4 16.19,55.88 17.94,54.13 24.29,54.13 | v20.32,34.92 20.32,34.61 | C12.2 74.14,30.48 | 74.14,30.48 76.99,30.48 78.26,29.21 C13.2 | IC5.4 68.74,26.51 68.9,26.35 69.22,26.35 70.48,25.08 70.48,24.29 72.07,24.29 73.18,25.4 C11.2 74.14,26.19 75.88,26.19 76.2,25.88 76.2,22.38 74.45,22.38 S7.4 74.3,22.23 71.91,22.23 71.75,22.07 C10.2 | v69.69,33.5 68.9,33.5 68.74,33.66 IC5.15 | v74.14,29.05 74.14,30.48 | T2.3 72.55,11.43 73.5,10.48 80.17,10.48 81.6,9.05 X3.5 | X2.5 48.74,8.89 C21.2 64.29,8.89 v64.29,7.46 | 52.7,27.62 52.7,29.37 52.86,29.37 C14.2 52.86,29.53 52.86,32.23 C15.2 | 52.7,27.62 52.7,25.72 C16.2 52.7,25.56 53.5,25.56 53.5,22.38 S1.4 | T7.3 29.21,18.41 29.69,18.89 30.96,18.89 31.27,19.21 35.24,19.21 T6.3 | T5.3 48.26,27.62 | 48.26,27.62 48.26,25.72 C17.2 | IC1.1 34.29,23.65 35.4,22.54 43.18,22.54 43.34,22.38 S2.4 | 48.26,27.62 52.7,27.62 | T12.3 65.72,20 67.63,20 68.42,19.21 85.72,19.21 86.04,19.53 S8.2
  Bottom 0.152: T9.3 92.87,20.48 92.87,19.68 86.2,19.68 S8.2 | IC4.2 99.85,49.37 105.25,49.37 105.25,40.16 106.2,39.21 S6.4 | S3.4 16.03,55.88 13.02,52.86 13.02,40.48 U$1.3 13.02,40.32 16.03,40.32 16.03,39.21 S5.4 16.19,39.05 v20.32,34.92 19.68,34.29 19.68,23.97 28.26,15.4 29.21,15.4 T7.3 | v69.69,33.5 v74.14,29.05 74.3,28.89 74.3,22.38 S7.4 74.3,22.23 71.44,19.37 71.44,11.43 T2.3 71.28,11.43 67.79,7.94 64.29,7.94 | 64.29,7.94 64.29,13.34 64.93,13.97 | 64.29,7.94 v64.29,7.46 64.29,3.02 64.14,2.86 T11.3 | T12.3 64.93,18.89 64.93,13.97 | 64.93,13.97 T10.3 | X2.4 47.94,7.78 48.58,8.41 48.58,8.89 X2.5 48.58,9.05 47.62,10 47.62,13.81 43.34,18.1 | 44.93,28.26 44.93,26.35 43.97,25.4 T3.3 43.81,25.4 43.5,25.08 43.5,22.38 S2.4 43.34,22.23 43.34,18.1 | 44.93,28.26 44.93,30.16 43.97,31.11 T4.3 | 44.93,28.26 48.26,28.26 T5.3 | T6.3 36.83,17.78 43.34,17.78 43.34,18.1
IO1_0  (via drill 0.38)
  Top 0.152: 58.1,29.37 54.93,29.37 C14.1 | 58.1,29.37 60.64,29.37 60.8,29.21 IC5.31 | v73.66,26.83 75.41,26.83 R28.1 | v70.17,23.34 60.96,23.34 60.8,23.5 59.37,23.5 58.26,22.38 S1.2 | v58.1,29.05 58.1,29.37
  Bottom 0.152: v70.17,23.34 v73.66,26.83 | v58.1,29.05 58.1,22.38 S1.2
IO1_1  (via drill 0.38)
  Top 0.152: 53.82,30.8 53.82,32.23 54.77,32.23 C15.1 | 53.82,30.8 53.82,28.57 53.98,28.42 60.8,28.42 IC5.32 | v88.11,28.57 88.11,27.46 R29.1 | v80.49,37.78 65.88,37.78 65.56,37.47 53.18,37.47 52.55,36.83 51.59,36.83 v51.28,37.15 | v53.5,30.8 53.82,30.8
  Bottom 0.152: v88.11,28.57 80.49,36.2 v80.49,37.78 | v51.28,37.15 49.21,35.08 49.21,30.8 | 49.21,30.8 49.21,23.5 48.1,22.38 S2.2 | 49.21,30.8 v53.5,30.8
IO1_2  (via drill 0.38)
  Top 0.152: v60.48,22.86 60.33,22.86 60.33,21.59 R30.1 | IC5.33 60.8,27.78 60.17,27.78 v59.85,27.46 56.36,27.46 54.61,25.72 | 54.61,25.72 v53.34,26.99 | 54.61,25.72 C16.1
  Bottom 0.152: v60.48,22.86 60.48,26.83 v59.85,27.46 | v53.34,26.99 51.59,25.24 51.59,6.83 45.56,6.83 31.75,20.64 31.75,21.11 30.32,21.11 25.24,26.19 25.24,51.44 20.8,55.88 S3.2
IO1_3  (via drill 0.38)
  Top 0.152: 60.33,20.16 60.33,19.05 R31.1 | v60.96,20.16 60.33,20.16 | v62.07,26.51 61.44,27.15 60.96,27.15 IC5.34 | v52.23,23.65 50.32,25.56 C17.1 | 60.33,20.16 v52.55,20.16
  Bottom 0.152: v60.96,20.16 62.07,21.27 v62.07,26.51 | v52.23,23.65 52.55,23.34 v52.55,20.16 54.61,18.1 54.61,1.59 76.68,1.59 82.87,7.78 82.87,9.21 96.2,22.54 96.2,25.24 107.31,36.35 107.31,52.39 110.81,55.88 S4.2
IO4_0  (via drill 0.38)
  Top 0.152: v28.89,47.62 28.42,47.62 26.04,50.01 25.24,50.01 X1.17 | v30.48,26.99 31.11,26.35 34.13,26.35 IC1.3 34.29,26.35 34.92,26.99 37.15,26.99 37.78,27.62 v39.05,27.62 | IC2.3 102.71,28.57 102.08,29.21 91.6,29.21 85.88,34.92 68.74,34.92 IC5.17 68.58,35.08 67.63,35.08 v67.47,35.24
  Bottom 0.152: v28.89,47.62 30.48,46.04 v30.48,26.99 | v39.05,27.62 38.58,28.1 38.58,31.11 42.86,35.4 44.29,35.4 44.29,34.92 45.24,33.97 46.35,33.97 46.35,39.69 47.62,40.96 67.47,40.96 v67.47,35.24
IO4_1  (via drill 0.38)
  Top 0.152: v28.26,30.16 30.8,27.62 34.13,27.62 IC1.4 | X1.18 25.24,50.64 26.04,50.64 27.94,48.74 v28.26,48.74 28.57,48.42 29.21,48.42 31.75,45.88 31.75,43.5 34.61,40.64 v69.37,40.64 | IC5.18 68.74,35.56 v70.33,35.56 86.52,35.56 91.6,30.48 102.08,30.48 102.71,29.84 IC2.4
  Bottom 0.152: v28.26,30.16 v28.26,48.74 | v69.37,40.64 70.33,39.69 v70.33,35.56
IO4_2  (via drill 0.38)
  Top 0.152: v28.1,49.85 27.3,49.85 26.04,51.12 25.24,51.12 X1.19 | v31.11,31.43 34.13,31.43 IC1.7 | 69.69,36.35 86.2,36.35 88.27,34.29 102.08,34.29 102.71,33.66 IC2.7 | 69.69,36.35 68.74,36.35 IC5.19 | v32.23,38.1 32.54,38.42 56.2,38.42 56.52,38.1 61.12,38.1 62.39,39.37 v68.74,39.37 | 69.69,36.35 v69.69,36.51
  Bottom 0.152: v28.1,49.85 31.11,46.83 31.11,38.1 | v31.11,31.43 31.11,38.1 | v32.23,38.1 31.11,38.1 | v68.74,39.37 69.69,38.42 v69.69,36.51
IO4_3  (via drill 0.38)
  Top 0.152: v59.85,36.51 60.64,36.51 60.8,36.35 IC5.20 | v45.72,32.86 43.02,32.86 42.39,33.5 38.89,33.5 37.78,32.38 34.45,32.38 34.29,32.54 IC1.8 34.13,32.7 29.37,32.7 v27.46,34.61 | v27.46,50.64 26.99,50.64 26.04,51.59 25.24,51.59 X1.20 | v90.65,35.56 102.08,35.56 102.71,34.92 IC2.8 | v63.98,40.01 v86.2,40.01
  Bottom 0.152: v59.85,36.51 58.58,37.78 58.58,39.37 58.26,39.69 | 58.26,39.69 46.83,39.69 46.83,33.97 v45.72,32.86 | v27.46,34.61 v27.46,50.64 | v86.2,40.01 v90.65,35.56 | v63.98,40.01 63.34,40.64 58.26,40.64 58.26,39.69
IO4_4  (via drill 0.38)
  Top 0.152: v26.51,52.07 25.24,52.07 X1.21 | v25.88,32.7 24.29,32.7 IC1.13 | IC5.21 60.96,35.72 61.12,35.88 v62.07,35.88 66.67,35.88 68.26,37.47 79.85,37.47 80.17,37.15 87.79,37.15 88.9,36.04 88.9,34.77 92.55,34.77 92.71,34.92 IC2.13 | v26.83,38.73 56.36,38.73 56.67,38.42 58.9,38.42 v59.21,38.73
  Bottom 0.152: v26.51,52.07 25.88,51.44 25.88,38.73 | v25.88,32.7 25.88,38.73 | v26.83,38.73 25.88,38.73 | v62.07,35.88 v59.21,38.73
IO4_5  (via drill 0.38)
  Top 0.152: v35.88,35.4 45.72,35.4 46.2,34.92 60.8,34.92 IC5.22 | v31.43,48.1 26.83,52.7 25.4,52.7 25.24,52.55 X1.22
  Bottom 0.152: v35.88,35.4 31.91,39.37 31.43,39.37 v31.43,48.1
IO4_6  (via drill 0.38)
  Top 0.152: v45.56,34.61 60.64,34.61 60.8,34.45 IC5.23 | v38.89,41.27 38.58,41.59 34.13,41.59 32.07,43.66 32.07,53.02 25.24,53.02 X1.23
  Bottom 0.152: v38.89,41.27 v45.56,34.61
IO4_7  (via drill 0.38)
  Top 0.152: v43.18,34.77 44.29,34.77 45.09,33.97 60.64,33.97 60.8,33.81 IC5.24 | v27.78,53.66 25.24,53.66 X1.24
  Bottom 0.152: v43.18,34.77 43.02,34.61 43.02,32.07 39.85,28.89 39.85,27.46 39.37,26.99 37.78,26.99 37.78,38.89 35.08,41.59 32.07,41.59 32.07,49.37 v27.78,53.66
J2_1
  Top 0.152: U$3.P$3 R12.1
  Bottom 0.152: U$3.P$3 24.13,16.51 24.13,10.64 25.08,9.68 K2.3
J2_3  (via drill 0.38)
  Top 0.152: v22.86,14.61 26.04,17.78 R12.2 | U$3.P$4 30.8,7.62 32.7,9.53 K2.10
  Bottom 0.152: U$3.P$4 v22.86,14.61
J3_1
  Top 0.152: 100.81,9.68 100.81,7.62 U$4.P$3 | 100.81,9.68 100.81,19.05 R27.1 | 100.81,9.68 94.3,9.68 K3.3
J3_3
  Top 0.152: 103.66,17.78 102.39,19.05 R27.2 | 103.66,17.78 103.66,9.68 101.92,9.68 K3.10 | 103.66,17.78 U$4.P$4
LD_/C  (via drill 0.38)
  Top 0.152: v57.94,31.91 59.21,30.64 60.64,30.64 60.8,30.48 IC5.29 | v57.94,39.05 57.31,39.69 36.35,39.69 36.04,39.37 35.4,39.37 28.73,46.04 25.24,46.04 X1.9
  Bottom 0.152: v57.94,39.05 v57.94,31.91
LHVTRIG  (via drill 0.38)
  Top 0.152: v13.49,31.91 13.49,33.02 R13.1 | v21.75,19.53 21.75,23.18 21.59,23.34 21.59,25.72 36.35,25.72 37.62,26.99 40.96,26.99 42.86,28.89 45.56,28.89 45.88,28.57 46.83,28.57 v47.62,29.37 | v56.04,32.7 58.9,29.84 60.8,29.84 IC5.30
  Bottom 0.152: v13.49,31.91 19.37,26.04 19.37,21.91 v21.75,19.53 | v47.62,29.37 47.31,29.69 47.31,34.13 51.28,38.1 56.04,38.1 v56.04,32.7
LRD  (via drill 0.38)
  Top 0.152: v69.69,30.32 68.9,30.32 68.74,30.48 IC5.10 | v70.01,15.08 65.56,10.64 61.12,10.64 60.48,10 51.28,10 48.58,12.7 v40.64,12.7 | v28.89,46.67 28.42,47.15 25.24,47.15 X1.11
  Bottom 0.152: v69.69,30.32 69.53,30.16 69.53,21.27 70.01,20.8 v70.01,15.08 | v40.64,12.7 28.89,24.45 v28.89,46.67
LRESET  (via drill 0.38)
  Top 0.152: v57.15,32.54 60.8,32.54 IC5.26 | v56.99,39.05 32.07,39.05 26.04,45.09 25.24,45.09 X1.7
  Bottom 0.152: v57.15,32.54 56.99,32.7 v56.99,39.05
LTS+
  Bottom 0.152: K2.8 32.86,4.6 40.48,4.6 40.48,2.22 X4.1
LTS-
  Top 0.152: K2.5 25.24,4.6 27.3,6.67 39.37,6.67 40.48,7.78 40.48,8.1 X4.3
LVSEL  (via drill 0.38)
  Top 0.152: v62.07,33.66 64.77,33.66 65.25,33.18 68.58,33.18 IC5.14 | v59.21,33.34 47.15,33.34 46.04,32.23 43.02,32.23 42.39,31.59 35.72,31.59 35.24,32.07 v22.54,32.07 | v22.54,35.24 24.13,35.24 IC1.11
  Bottom 0.152: v62.07,33.66 59.21,33.66 v59.21,33.34 | v22.54,35.24 v22.54,32.07
LWR  (via drill 0.38)
  Top 0.152: v65.25,29.69 68.58,29.69 IC5.9 | v64.29,23.97 64.14,24.13 v56.2,24.13 | v52.23,37.47 51.91,37.78 48.58,37.78 47.62,36.83 23.97,36.83 23.5,37.31 15.88,37.31 15.08,38.1 15.08,46.51 25.08,46.51 X1.10
  Bottom 0.152: v65.25,29.69 64.29,28.73 v64.29,23.97 | v56.2,24.13 54.13,26.19 54.13,35.56 v52.23,37.47
N$1
  Top 0.152: R1.1 36.83,25.08 34.29,25.08 IC1.2
N$2
  Top 0.152: R2.1 36.83,28.57 36.67,28.73 34.29,28.73 IC1.5
N$3
  Top 0.152: R3.1 36.83,30 34.29,30 IC1.6
N$4
  Top 0.152: R4.1 36.83,33.97 34.29,33.97 IC1.9
N$5  (via drill 0.38)
  Top 0.152: v29.21,23.18 29.21,21.59 R5.1 | v26.83,32.7 25.72,33.81 24.29,33.81 IC1.12
  Bottom 0.152: v29.21,23.18 26.83,25.56 v26.83,32.7
N$6  (via drill 0.38)
  Top 0.152: L3.2 118.11,53.98 116.2,53.98 SG1.1 116.2,53.82 v113.98,51.59
  Bottom 0.152: v113.98,51.59 113.98,46.35 111.6,43.97 T1.1
N$7  (via drill 0.38)
  Top 0.152: v37.15,33.02 38.1,33.97 R4.2
  Bottom 0.152: v37.15,33.02 36.67,32.54 36.67,21.27 T6.2
N$8
  Top 0.152: T7.2 30.48,21.59 R5.2
N$9
  Top 0.152: U$1.4 U$1.2 | U$3.P$1 3.65,18.89 21.11,18.89 21.11,28.1 21.59,28.57 22.07,28.57 22.7,29.21 D2.A
  Bottom 0.152: U$3.P$1 2.54,27.78 12.86,38.1 U$1.2
N$10
  Top 0.152: R7.1 26.04,22.23 25.08,23.18 22.23,23.18 21.91,23.5 21.91,24.45 41.12,24.45 43.81,27.15 43.81,27.94 T3.1
N$11  (via drill 0.38)
  Top 0.152: v38.58,20.32 31.91,20.32 30.8,19.21 26.99,19.21 26.19,20 R8.1
  Bottom 0.152: v38.58,20.32 43.02,24.77 43.02,31.59 43.81,32.38 43.81,33.66 T4.1
N$12
  Top 0.152: R9.1 21.75,26.67 21.75,28.26 25.4,28.26 27.94,30.8 43.02,30.8 43.5,30.32 45.88,30.32 46.2,30.64 48.26,30.64 T5.1
N$13
  Top 0.152: T3.2 39.69,26.67 38.26,25.24 R1.2
N$14  (via drill 0.38)
  Top 0.152: v39.21,28.89 38.58,28.89 38.26,28.57 R2.2
  Bottom 0.152: v39.21,28.89 41.91,31.59 41.91,32.38 T4.2
N$15
  Top 0.152: R3.2 38.26,29.84 38.58,29.53 46.35,29.53 T5.2
N$16
  Top 0.152: R10.1 37.94,16.83 37.94,19.21 T6.1
N$17
  Top 0.152: R8.2 24.77,20.16 24.77,22.07 R7.2 | R10.2 36.67,16.83 36.2,17.3 27.78,17.3 25.72,19.37 25.4,19.37 24.77,20 R8.2 | R9.2 C1.2 18.1,26.67 | 17.94,28.57 17.94,26.67 18.1,26.67 | 17.94,28.57 17.94,28.89 R11.2 17.94,28.57 | IC7.7 4.45,31.59 12.38,31.59 12.7,31.27 12.7,26.83 14.29,26.83 16.03,28.57 16.03,30 20.64,30 21.11,29.53 21.11,28.57 17.94,28.57 | 18.1,26.67 14.45,23.02 1.75,23.02 1.75,16.99 3.33,16.99 4.92,18.57 23.18,18.57 24.61,20 R8.2
N$18
  Top 0.152: D2.C 20.32,29.21 19.84,29.69 17.3,29.69 16.67,29.05 R11.1 16.51,28.89 16.35,28.89 16.35,26.67 C1.1 16.19,26.67 16.03,26.51 12.54,26.51 11.91,27.15 11.91,27.94 C5.1 11.75,29.21 | 11.75,29.21 C6.1 | 11.75,29.21 3.17,29.21 IC7.1 3.17,27.78 1.43,27.78 1.43,16.83 1.59,16.67 2.54,16.67 U$3.P$2
N$19
  Top 0.152: 115.73,38.1 115.73,35.4 111.76,31.43 111.76,29.21 D1.A | U$2.2 115.73,38.1 | U$4.P$1 124.46,16.99 125.25,16.99 125.25,38.1 U$2.4 115.73,38.1
N$20  (via drill 0.38)
  Top 0.152: v101.12,23.97 102.23,22.86 R15.1 | v101.12,26.04 102.39,27.3 IC2.2
  Bottom 0.152: v101.12,26.04 v101.12,23.97
N$21  (via drill 0.38)
  Top 0.152: v12.06,34.13 12.06,33.02 R13.2
  Bottom 0.152: v12.06,34.13 12.86,34.92 12.86,35.72 U$1.1
N$22  (via drill 0.38)
  Top 0.152: v74.93,33.18 73.5,33.18 73.18,32.86 R14.2 | v83.03,41.27 83.34,41.59 94.46,41.59 98.74,45.88 110.17,45.88 T1.2
  Bottom 0.152: v83.03,41.27 v74.93,33.18
N$23
  Top 0.152: R35.1 90.65,16.51 90.17,16.99 86.2,16.99 S8.1
N$24
  Top 0.152: IC2.5 104.14,31.11 104.14,29.21 105.89,27.46 105.89,26.67 R16.1
N$25
  Top 0.152: IC2.6 103.35,32.38 104.78,30.96 105.89,30.96 105.89,29.21 R17.1
N$26
  Top 0.152: IC2.9 105.25,36.2 105.89,35.56 R18.1
N$27
  Top 0.152: IC2.12 90.33,36.2 89.69,35.56 R19.1
N$29  (via drill 0.38)
  Top 0.152: v97.79,21.27 99.22,21.27 100.81,22.86 R15.2 | v90.17,13.65 89.85,13.34 T2.2
  Bottom 0.152: v90.17,13.65 v97.79,21.27
N$30
  Top 0.152: T9.2 96.84,25.08 107.31,25.08 107.31,26.67 R16.2
N$31  (via drill 0.38)
  Top 0.152: v106.2,28.1 107.31,29.21 R17.2 | v102.55,24.45 102.39,24.61 98.27,24.61 94.14,20.48 77.63,20.48 77.47,20.64 75.09,20.64 74.93,20.48 73.03,20.48 72.39,21.11 v68.1,21.11
  Bottom 0.152: v102.55,24.45 v106.2,28.1 | v68.1,21.11 66.36,19.37 66.36,15.88 T10.2
N$32  (via drill 0.38)
  Top 0.152: v107.31,34.45 107.31,35.56 R18.2 | v79.06,2.06 68.58,2.06 66.04,4.6 65.41,4.6 T11.2
  Bottom 0.152: v107.31,34.45 105.89,34.45 99.69,28.26 99.69,22.07 87.63,10 84.14,10 84.14,7.14 v79.06,2.06
N$33  (via drill 0.38)
  Top 0.152: v65.88,34.61 68.42,37.15 70.01,37.15 70.33,36.83 86.84,36.83 88.11,35.56 R19.2
  Bottom 0.152: v65.88,34.61 65.88,21.11 T12.2
N$34
  Top 0.152: K3.1 94.14,14.76 93.98,14.76 92.23,16.51 R35.2 92.08,16.51 89.53,13.97 73.98,13.97 71.12,16.83 65.88,16.83 64.77,15.72 60.8,15.72 58.74,13.65 26.19,13.65 25.24,14.61 K2.1
N$35  (via drill 0.38)
  Top 0.152: v73.66,6.99 72.71,6.99 R22.1
  Bottom 0.152: v73.66,6.99 73.82,7.14 73.82,11.43 T2.1
N$36
  Top 0.152: T9.1 97,21.59 97,19.05 R23.1
N$37  (via drill 0.38)
  Top 0.152: v66.99,9.37 67.31,9.37 67.79,8.89 R24.1
  Bottom 0.152: v66.99,9.37 67.47,9.84 67.47,13.97 T10.1
N$38
  Top 0.152: R25.1 67.79,7.3 66.2,5.71 64.93,5.71 64.29,5.08 64.29,3.81 65.56,3.81 66.52,2.86 T11.1
N$39  (via drill 0.38)
  Top 0.152: R24.2 69.22,8.89 69.22,7.46 R25.2 69.22,7.3 69.22,5.71 R26.2 69.22,5.56 69.22,5.08 69.85,4.45 71.44,4.45 72.55,5.56 R22.2 72.71,5.71 v81.76,5.71 | v88.74,17.62 97,17.62 98.42,19.05 R23.2 98.58,19.05 99.69,20.16 106.2,20.16 v106.52,20.48 | C2.2 81.28,12.06 v83.19,12.06 83.5,12.06 v83.5,8.89 | IC8.7 121.28,31.75 v117.79,31.75
  Bottom 0.152: v83.19,12.06 v88.74,17.62 | v106.52,20.48 v117.79,31.75 | v81.76,5.71 83.5,7.46 v83.5,8.89
N$40
  Top 0.152: 82.55,8.26 81.12,6.83 78.9,6.83 78.11,7.62 70.64,7.62 70.64,5.71 R26.1 | 82.55,8.26 82.55,10.95 80.33,10.95 79.38,11.91 C2.1 | C8.1 110.65,27.94 109.38,29.21 D1.C | C8.1 C7.1 | C8.1 114.78,27.94 115.89,26.83 118.43,26.83 | 118.43,26.83 119.06,26.83 120.02,27.78 IC8.1 | 118.43,26.83 120.81,29.21 124.46,29.21 U$4.P$2 113.35,6.67 84.14,6.67 82.55,8.26
N$42  (via drill 0.38)
  Top 0.152: R21.2 90.33,29.21 91.6,27.94 v104.46,27.94
  Bottom 0.152: v104.46,27.94 109.86,33.34 109.86,36.04 113.98,40.16 113.98,40.32 U$2.1
N$45  (via drill 0.38)
  Top 0.152: v6.99,23.65 IC7.4
  Bottom 0.152: v6.99,23.65 22.07,8.57 22.07,6.83 31.43,6.83 31.43,17.94 31.75,18.26 T7.1
N$47  (via drill 0.38)
  Top 0.152: IC8.4 123.83,19.84 100.49,19.84 95.25,14.61 95.25,13.02 73.66,13.02 73.03,12.38 v70.48,12.38
  Bottom 0.152: v70.48,12.38 67.31,15.56 T12.1
RHVTRIG  (via drill 0.38)
  Top 0.152: v80.8,30.64 80.8,29.21 R21.1 | v66.52,26.19 66.67,26.04 68.58,26.04 IC5.3
  Bottom 0.152: v80.8,30.64 79.38,32.07 79.38,33.02 77.95,34.45 76.83,34.45 76.83,33.97 75.41,32.54 71.12,32.54 71.12,33.02 70.01,34.13 68.42,34.13 68.42,23.65 68.1,23.34 66.2,23.34 66.2,25.88 v66.52,26.19
RTS+
  Top 0.152: K3.8 101.76,4.45 100.33,3.02 90.81,3.02 90.01,2.22 X5.1
RTS-
  Bottom 0.152: K3.5 94.14,4.6 90.01,4.6 90.01,8.1 X5.3
RVSEL  (via drill 0.38)
  Top 0.152: v64.45,33.02 60.96,33.02 IC5.25 | v65.25,38.1 65.56,38.42 91.76,38.42 92.71,37.47 IC2.11
  Bottom 0.152: v64.45,33.02 65.25,33.81 v65.25,38.1
SCL  (via drill 0.38)
  Top 0.152: v65.25,32.23 68.42,32.23 68.58,32.38 IC5.13 | v63.5,6.83 46.99,6.83 46.2,7.62 X2.2
  Bottom 0.152: v65.25,32.23 64.14,31.11 64.14,29.05 63.66,28.57 63.66,6.83 | 63.66,6.83 63.66,3.81 63.02,3.17 63.02,2.38 63.5,1.91 75.25,1.91 75.25,4.92 77.95,7.62 79.06,7.62 X3.2 | 63.66,6.83 v63.5,6.83
SDA  (via drill 0.38)
  Top 0.152: v77.47,33.81 71.6,33.81 69.69,31.91 68.74,31.91 IC5.12 | v46.99,10.48 47.31,10.16 50.64,10.16 51.12,9.68 62.39,9.68 63.02,10.32 73.18,10.32 73.66,9.84 79.22,9.84 80.01,9.05 X3.3
  Bottom 0.152: v77.47,33.81 79.06,32.23 79.06,24.45 80.01,23.5 X3.3 | v46.99,10.48 X2.3
SPKR
  Top 0.152: R14.1 71.6,32.7 70.17,31.27 68.74,31.27 IC5.11
TCK  (via drill 0.38)
  Top 0.152: 60.17,17.62 60.17,16.51 R32.1 | v59.85,26.51 60.8,26.51 IC5.35 | TP4.TP 11.27,48.42 v13.65,48.42 | C18.1 20.64,39.21 S5.2 | 60.17,17.62 40.01,17.62 38.42,16.03 v28.57,16.03 | 60.17,17.62 v60.17,17.94
  Bottom 0.152: v60.17,17.94 59.85,18.26 59.85,24.61 60.17,24.92 60.17,26.19 v59.85,26.51 | v13.65,48.42 20.64,41.43 20.64,39.21 S5.2 20.8,39.05 21.75,38.1 21.75,22.86 v28.57,16.03
TDI  (via drill 0.38)
  Top 0.152: C20.1 79.06,22.38 S7.2 | v10,52.23 TP2.TP | v21.91,14.61 23.18,13.34 58.26,13.34 59.05,12.54 | 59.05,12.54 60.17,11.43 R34.1 | v59.53,25.24 60.8,25.24 IC5.37 | 59.05,12.54 v59.53,13.02 | v78.26,17.94 78.11,17.78 v62.23,17.78
  Bottom 0.152: v10,52.23 11.27,50.96 11.27,40.01 12.22,39.05 14.61,39.05 14.61,33.97 12.86,32.23 12.86,23.65 v21.91,14.61 | v59.53,13.02 59.53,15.08 | 59.53,15.08 v59.53,25.24 | v78.26,17.94 78.26,21.59 78.9,22.23 S7.2 | 59.53,15.08 v62.23,17.78
TDO  (via drill 0.38)
  Top 0.152: R36.1 89.38,21.59 88.9,22.07 86.2,22.07 S8.3 | v2.06,61.44 TP1.TP | v8.1,10.64 42.07,10.64 46.51,6.19 v62.23,6.19 63.98,6.19 65.56,7.78 65.56,8.89 C21.1 | v62.71,24.77 60.96,24.77 IC5.38 | v82.55,18.57 68.1,18.57 67.63,18.1 63.34,18.1 v63.02,18.41
  Bottom 0.152: v2.06,61.44 1.75,61.12 1.75,16.99 v8.1,10.64 | v62.71,24.77 62.87,24.61 62.87,18.41 | 62.87,18.41 62.87,7.78 62.23,7.14 v62.23,6.19 | v82.55,18.57 86.04,22.07 S8.3 | 62.87,18.41 v63.02,18.41
TEST  (via drill 0.38)
  Top 0.152: TP6.TP 14.76,42.39 14.76,36.51 58.9,36.51 59.53,37.15 v66.2,37.15 | v66.83,24.45 66.99,24.61 68.58,24.61 IC5.1 68.74,24.61 69.37,23.97 72.23,23.97 72.39,24.13 74.14,24.13 75.41,25.4 R20.1
  Bottom 0.152: v66.2,37.15 66.83,36.51 66.83,26.83 67.15,26.51 67.15,25.88 66.83,25.56 v66.83,24.45
TMS  (via drill 0.38)
  Top 0.152: 103.35,40.96 103.35,41.91 103.66,42.23 104.78,42.23 105.41,42.86 C19.1 | 103.35,40.96 109.06,40.96 110.81,39.21 S6.2 | TP3.TP 9.37,51.59 v20.8,51.59 | 58.9,10.64 60.64,10.64 60.96,10.95 60.96,13.97 R33.1 | 58.9,10.64 v53.98,10.64 | v58.74,25.88 60.8,25.88 IC5.36 60.96,25.88 63.34,25.88 65.41,23.81 67.63,23.81 v67.79,23.97 | 58.9,10.64 v58.9,10.95 | 103.35,40.96 88.11,40.96 86.52,39.37 v75.09,39.37
  Bottom 0.152: v20.8,51.59 24.92,47.47 24.92,24.45 30.16,19.21 32.7,19.21 45.4,6.51 53.98,6.51 v53.98,10.64 | v58.74,25.88 58.9,25.72 58.9,23.81 59.21,23.5 59.21,13.65 58.9,13.34 v58.9,10.95 | v75.09,39.37 70.17,34.45 68.1,34.45 68.1,24.29 v67.79,23.97
VCC  (via drill 0.38)
  Top 0.152: v35.4,12.06 42.23,12.06 45.24,9.05 X2.1 45.4,9.05 46.2,9.84 50.48,9.84 50.96,9.37 62.55,9.37 63.18,10 69.85,10 | v77.47,32.7 78.11,32.7 78.11,31.75 R6.2 | v77.15,20 71.75,20 C10.1 | 69.85,10 73.03,10 73.98,9.05 78.26,9.05 X3.1 | v115.73,45.09 115.73,43.5 IC3.3 | L3.1 118.11,63.82 116.2,63.82 SG1.2 | 69.85,10 69.85,4.92 70.01,4.92 70.17,4.76 70.8,4.76 71.91,5.87 71.91,6.35 101.44,6.35 102.87,4.92 102.87,2.06 101.92,2.06 K3.7
  Bottom 0.152: K2.12 32.86,14.61 v35.4,12.06 35.4,10.95 31.75,7.3 31.75,3.02 32.7,2.06 K2.7 | v77.47,32.7 77.63,32.54 77.63,20 | 77.63,20 77.63,9.68 78.26,9.05 X3.1 | 77.63,20 v77.15,20 | K3.7 101.76,2.06 100.81,3.02 100.81,13.65 101.76,14.61 K3.12 101.92,14.76 102.55,15.4 102.55,22.23 115.73,35.4 v115.73,45.09 114.62,46.2 114.62,62.23 116.2,63.82 SG1.2
XIN
  Top 0.152: 71.44,28.73 72.39,28.73 Q3.2 | 71.44,28.73 71.12,28.73 70.48,28.1 68.9,28.1 68.74,27.94 IC5.6 | 71.44,28.73 C12.1
XOUT
  Top 0.152: 71.44,27.15 72.39,27.15 Q3.1 | 71.44,27.15 68.74,27.15 IC5.5 | 71.44,27.15 C11.1
(copper drawn outside any net)
  shapes: Bottom area x1, Top area x1